# EAGLE design vu (EAGLE 9.3.0)
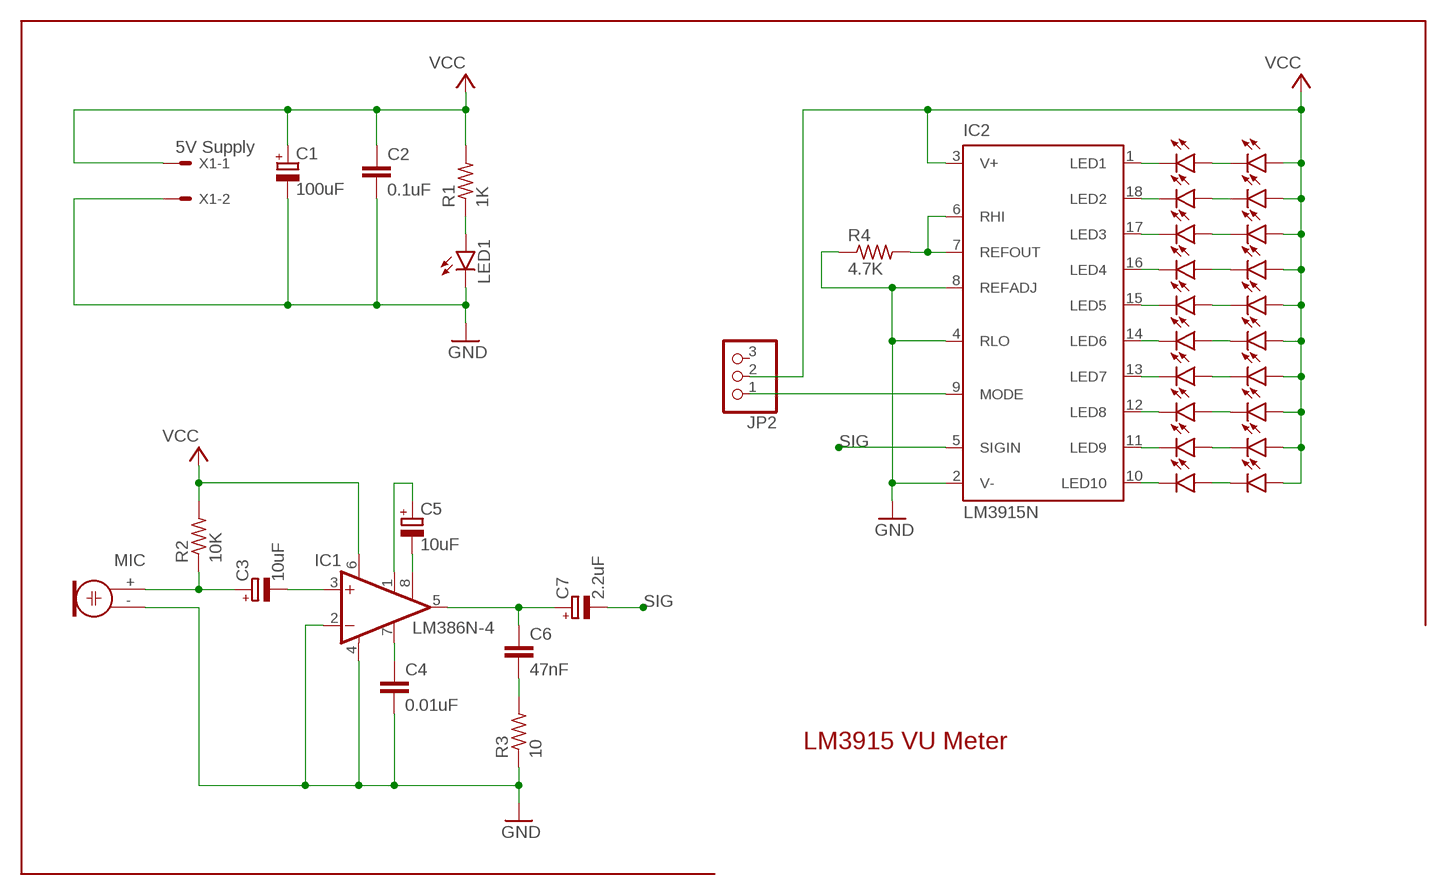
[diagram p0: schematic, sheet 1]

## Parts
C1  100uF  CPOL-EUE2.5-6  [E2,5-6]
C2  0.1uF  C-EU025-050X050  [C025-050X050]
C3  10uF  CPOL-EUE2.5-6  [E2,5-6]
C4  0.01uF  C-EU050-024X044  [C050-024X044]
C5  10uF  CPOL-EUE2.5-6  [E2,5-6]
C6  47nF  C-EU025-050X050  [C025-050X050]
C7  2.2uF  CPOL-EUE5-6  [E5-6]
IC1  LM386N-4  [DIL08]
IC2  LM3915N  [DIL18]
JP2  PINHD-1X3  [1X03]
LED1  LED5MM  [LED5MM]
LED2  LED5MM  [LED5MM]
LED3  LED5MM  [LED5MM]
LED4  LED5MM  [LED5MM]
LED5  LED5MM  [LED5MM]
LED6  LED5MM  [LED5MM]
LED7  LED5MM  [LED5MM]
LED8  LED5MM  [LED5MM]
LED9  LED5MM  [LED5MM]
LED10  LED5MM  [LED5MM]
LED11  LED5MM  [LED5MM]
LED12  LED5MM  [LED5MM]
LED13  LED5MM  [LED5MM]
LED14  LED5MM  [LED5MM]
LED15  LED5MM  [LED5MM]
LED16  LED5MM  [LED5MM]
LED17  LED5MM  [LED5MM]
LED18  LED5MM  [LED5MM]
LED19  LED5MM  [LED5MM]
LED20  LED5MM  [LED5MM]
LED21  LED5MM  [LED5MM]
MIC  ELECTRET  [9.7ELECTRET]
R1  1K  R-US_0207/10  [0207/10]
R2  10K  R-US_0207/10  [0207/10]
R3  10  R-US_0207/10  [0207/10]
R4  4.7K  R-US_0207/10  [0207/10]
X1  5V Supply  KK-156-2  [KK-156-2]

## Nets
GND: C1.- C2.2 C4.2 IC1.2(-IN) IC1.4(GND) IC2.2(V-) IC2.4(RLO) IC2.8(REFADJ) LED1.K(C) MIC.- R3.1 R4.1 X1.2
N$1: C3.+ MIC.+ R2.1
N$2: C3.- IC1.3(+IN)
N$3: C5.+ IC1.1(GAIN)
N$4: LED1.A R1.1
N$5: C5.- IC1.8(GAIN)
N$6: C6.1 C7.+ IC1.5(OUT)
N$7: IC2.6(RHI) IC2.7(REFOUT) R4.2
N$8: C6.2 R3.2
N$9: C4.1 IC1.7(BYPASS)
N$11: IC2.1(LED1) LED2.K(C)
N$12: LED2.A LED3.K(C)
N$13: IC2.18(LED2) LED4.K(C)
N$14: LED4.A LED5.K(C)
N$15: IC2.17(LED3) LED6.K(C)
N$16: LED6.A LED7.K(C)
N$17: LED8.A LED9.K(C)
N$18: IC2.16(LED4) LED8.K(C)
N$19: IC2.15(LED5) LED10.K(C)
N$20: LED10.A LED11.K(C)
N$21: LED12.A LED13.K(C)
N$22: IC2.14(LED6) LED12.K(C)
N$23: IC2.13(LED7) LED14.K(C)
N$24: LED14.A LED15.K(C)
N$25: LED16.A LED17.K(C)
N$26: IC2.12(LED8) LED16.K(C)
N$27: IC2.11(LED9) LED18.K(C)
N$28: LED18.A LED19.K(C)
N$29: LED20.A LED21.K(C)
N$30: IC2.10(LED10) LED20.K(C)
N$31: IC2.9(MODE) JP2.1
SIG: C7.- IC2.5(SIGIN)
VCC: C1.+ C2.1 IC1.6(VS) IC2.3(V+) JP2.2 LED3.A LED5.A LED7.A LED9.A LED11.A LED13.A LED15.A LED17.A LED19.A LED21.A R1.2 R2.2 X1.1
Unconnected: JP2.3

## Notes on the sheet
- LM3915 VU Meter

## Library data of the parts
C1 C3 C5 C7 = rcl:CPOL-EU: POLARIZED CAPACITOR, European symbol; SPICEPREFIX: C
C2 C4 C6 = rcl:C-EU: CAPACITOR, European symbol; SPICEPREFIX: C
IC1 = linear:LM386?-*: Low Voltage Audio Power Amplifier Source: http://cache.national.com/ds/LM/LM386.pdf
IC2 = national-semiconductor:LM391: Dot/Bar Display Driver Source: Data sheet LM3915 <http://www.national.com/ds/LM/LM3915.pdf> Data sheet LM3914 <http://www.national.com/ds/LM/LM3914.pdf>
JP2 = pinhead:PINHD-1X3: PIN HEADER
LED1-LED21 = led:LED: LED OSRAM: - CHIPLED LG R971, LG N971, LY N971, LG Q971, LY Q971, LO R971, LY R971 LH N974, LH R974 LS Q976, LO Q976, LY Q976 LO Q996 - Hyper CHIPLED LW Q18S LB Q993, LB Q99A, LB R99A - SideLED LS A670, LO A670, LY A670, LG A670, LP A670 LB A673, LV A673, LT A673, LW A673 LH A674 LY A675 LS A676, LA A676, LO A676, LY A676, LW A676 LS A679, LY A679, LG A679 - Hyper Micro SIDELED® LS Y876, LA Y876, LO Y876, LY Y876 LT Y87S - SmartLED LW L88C, LW L88S LB L89C, LB L89S, LG L890 LS L89K, LO L89K, LY L89K LS L896, LA L896, LO L896, LY L896 - TOPLED LS T670, LO T670, LY T670, LG T670, LP T670 LSG T670, LSP T670, LSY T670, LOP T670, LYG T670 LG T671, LOG T671, LSG T671 LB T673, LV T673, LT T673, LW T673 LH T674 LS T676, LA T676, LO T676, LY T676, LB T676, LH T676, LSB T676, LW T676 LB T67C, LV T67C, LT T67C, LS T67K, LO T67K, LY T67K, LW E67C LS E67B, LA E67B, LO E67B, LY E67B, LB E67C, LV E67C, LT E67C LW T67C LS T679, LY T679, LG T679 LS T770, LO T770, LY T770, LG T770, LP T770 LB T773, LV T773, LT T773, LW T773 LH T774 LS E675, LA E675, LY E675, LS T675 LS T776, LA T776, LO T776, LY T776, LB T776 LHGB T686 LT T68C, LB T68C - Hyper Mini TOPLED® LB M676 - Mini TOPLED Santana® LG M470 LS M47K, LO M47K, LY M47K Source: http://www.osram.convergy.de LUXEON: - LUMILED® LXK2-PW12-R00, LXK2-PW12-S00, LXK2-PW14-U00, LXK2-PW14-V00 LXK2-PM12-R00, LXK2-PM12-S00, LXK2-PM14-U00 LXK2-PE12-Q00, LXK2-PE12-R00, LXK2-PE12-S00, LXK2-PE14-T00, LXK2-PE14-U00 LXK2-PB12-K00, LXK2-PB12-L00, LXK2-PB12-M00, LXK2-PB14-N00, LXK2-PB14-P00, LXK2-PB14-Q00 LXK2-PR12-L00, LXK2-PR12-M00, LXK2-PR14-Q00, LXK2-PR14-R00 LXK2-PD12-Q00, LXK2-PD12-R00, LXK2-PD12-S00 LXK2-PH12-R00, LXK2-PH12-S00 LXK2-PL12-P00, LXK2-PL12-Q00, LXK2-PL12-R00 Source: www.luxeon.com KINGBRIGHT: KA-3528ASYC Source: www.kingbright.com
MIC = adafruit:ELECTRET: Electret microphone Thru hole 2.54mm spacing with 9.7mm diameter
R1-R4 = rcl:R-US_: RESISTOR, American symbol; SPICEPREFIX: R
X1 = con-molex:KK-156-2: KK 156 HEADER Source: http://www.molex.com/pdm_docs/sd/026604100_sd.pdf; MF: MOLEX; OC_FARNELL: unknown; OC_NEWARK: unknown

## Board
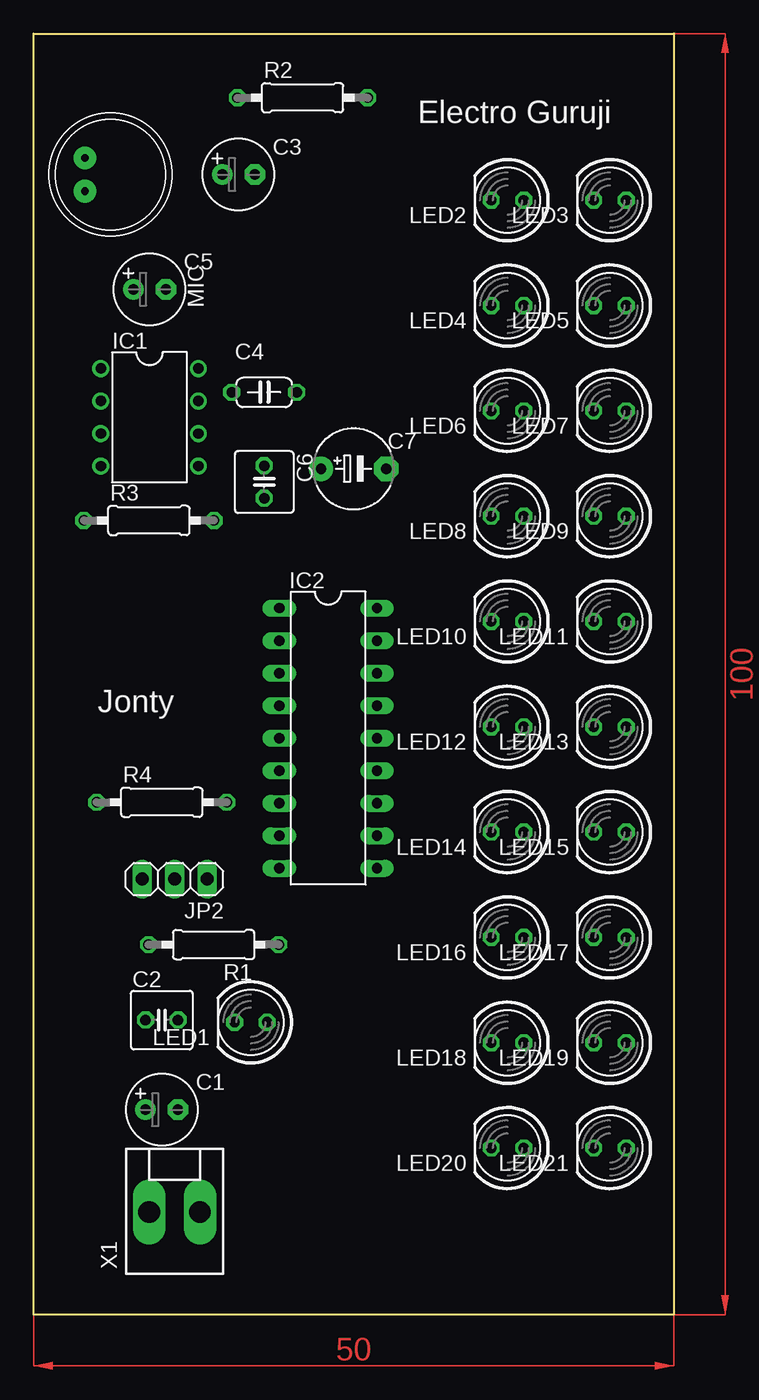
[diagram p1: board, top side]
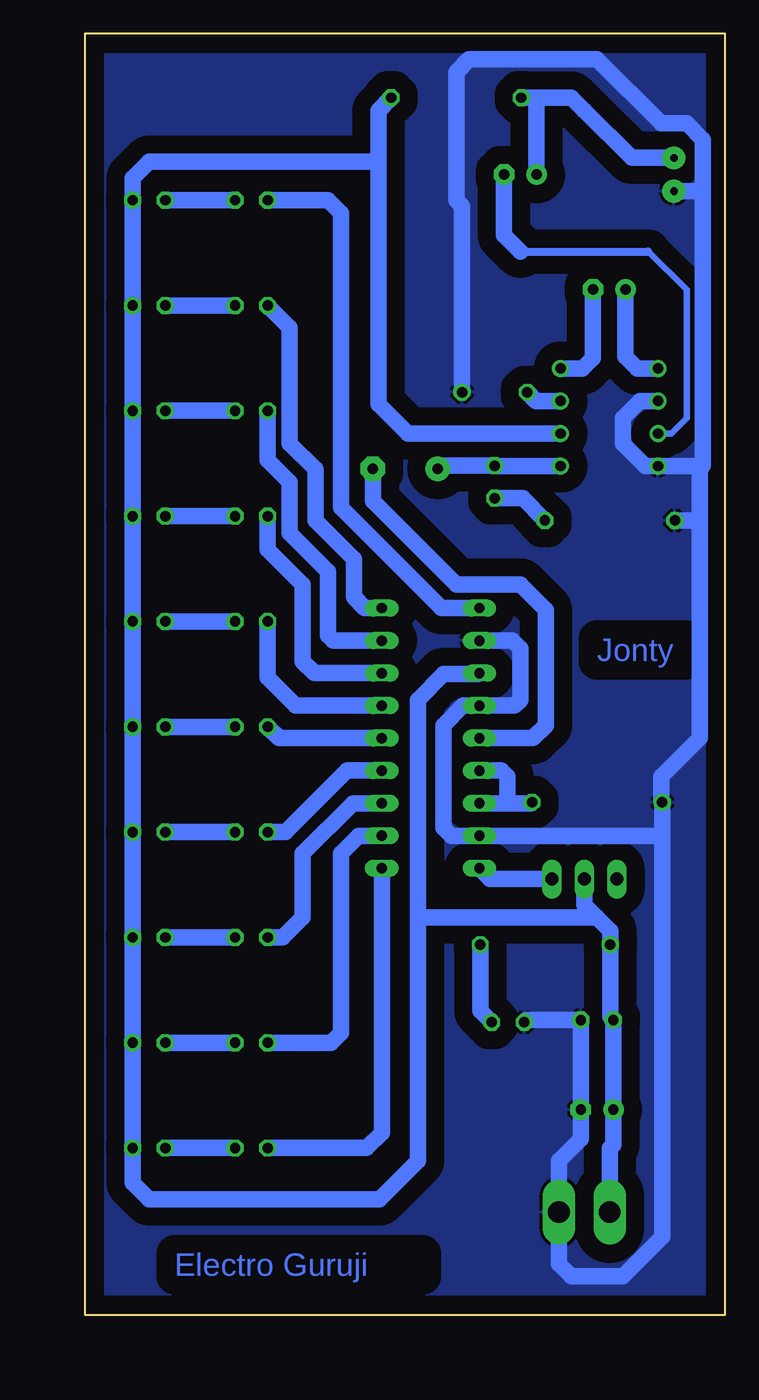
[diagram p2: board, bottom side, seen from below]

Size 50 x 100 mm. Coordinates in mm from the lower left corner, seen from the top.
Outline: 0,100 50,100 50,0 0,0 0,100
Copper layers (1*16): Top 0.035mm / dielectric 1.5mm / Bottom 0.035mm
Design rules "default": minimum track width 6mil, minimum drill 0.35mm, track to track 6mil, track to pad 6mil, pad to pad 6mil, via to via 6mil, smd to smd 6mil, copper to edge 40mil, drill to drill 6mil, minimum pad ring 10mil, minimum via ring 8mil, stop-mask expansion 4mil, vias tented up to drill 0mil, thermal gap 10mil

### Footprints (pad centres in the part's own frame; a part is rotated, then mirrored left to right if it is on the bottom)
E2,5-6 = drill 0.813 pad 1.6: + -1.27,0 | drill 0.813 pad 1.6 octagon: - 1.27,0
C025-050X050 = drill 0.813 octagon: 1 -1.27,0; 2 1.27,0
C050-024X044 = drill 0.813 octagon: 1 -2.54,0; 2 2.54,0
E5-6 = drill 0.813 pad 1.905: + -2.54,0 | drill 0.813 pad 1.905 octagon: - 2.54,0
DIL08 = drill 0.813 pad 1.27: 1 -3.81,-3.81; 2 -1.27,-3.81; 3 1.27,-3.81; 4 3.81,-3.81; 5 3.81,3.81; 6 1.27,3.81; 7 -1.27,3.81; 8 -3.81,3.81
DIL18 = drill 0.813 long: 1 -10.16,-3.81; 2 -7.62,-3.81; 3 -5.08,-3.81; 4 -2.54,-3.81; 5 0,-3.81; 6 2.54,-3.81; 7 5.08,-3.81; 8 7.62,-3.81; 9 10.16,-3.81; 10 10.16,3.81; 11 7.62,3.81; 12 5.08,3.81; 13 2.54,3.81; 14 0,3.81; 15 -2.54,3.81; 16 -5.08,3.81; 17 -7.62,3.81; 18 -10.16,3.81
1X03 = drill 1.016 long: 1 -2.54,0; 2 0,0; 3 2.54,0
LED5MM = drill 0.813 octagon: A -1.27,0; K 1.27,0
9.7ELECTRET = drill 0.6 pad 1.778: + 1.3,2; - -1.3,2
0207/10 = drill 0.813 octagon: 1 -5.08,0; 2 5.08,0
KK-156-2 = drill 1.7 pad 2.184 long: 1 -1.98,0; 2 1.98,0

### Placement (x,y rotation side)
C1  10,16 0 top
C2  10,23 0 top
C3  16,89 0 top
C4  18,72 0 top
C5  9.05,80.04 0 top
C6  18,65 270 top
C7  24.98,66.04 0 top
IC1  9.05,70.05 270 top
IC2  23,45 270 top
JP2  11,34 180 top
LED1  16.96,22.82 180 top
LED2  37,87 180 top
LED3  45,87 180 top
LED4  37,78.78 180 top
LED5  45,78.78 180 top
LED6  37,70.56 180 top
LED7  45,70.56 180 top
LED8  37,62.33 180 top
LED9  45,62.33 180 top
LED10  37,54.11 180 top
LED11  45,54.11 180 top
LED12  37,45.89 180 top
LED13  45,45.89 180 top
LED14  37,37.67 180 top
LED15  45,37.67 180 top
LED16  37,29.44 180 top
LED17  45,29.44 180 top
LED18  37,21.22 180 top
LED19  45,21.22 180 top
LED20  37,13 180 top
LED21  45,13 180 top
MIC  6,89 90 top
R1  14.05,28.88 180 top
R2  21,95 0 top
R3  9,62 0 top
R4  10,40 0 top
X1  11,8 0 top

### Tracks (layer width: path | path; a pad name or v marks a point on that pad's centre or on a via)
GND
  Bottom 1.27: IC2.2 16.62,52.62 16,52 16,48 16.46,47.54 IC2.4 20.46,47.54 22,46 22,38 21.38,37.38 IC2.8 5.3,37.38 4.92,37 | LED1.K 15.51,23 C2.2 C1.- 11.27,13.73 12.98,12.02 X1.2 12.98,3.98 12,3 8,3 4.92,6.08 4.92,37 | 4.92,37 R4.1 5,40.08 5,42 2,45 2,62 | 2,66 2,62 | R3.1 2,62 | 2,66 2.24,66.24 IC1.4 6.24,66.24 8,68 8,70 6.68,71.32 IC1.2 | C4.2 20.54,86.54 21,87 21,97 20,98 10,98 5,93 3,93 1.73,91.73 1.73,88 | MIC.- 2.03,87.7 1.73,88 | 2,66 1.73,66.27 1.73,88
  pour Bottom (isolate 1.422): 0,100 50,100 50,0 0,0
N$1
  Bottom 1.27: 15,95 R2.1 | C3.+ 14.73,94.73 15,95 | 15,95 12,95 11,94 7.3,90.3 MIC.+
N$2
  Bottom 0.508: IC1.3 4.22,68.78 3,70 3,80 6,83
  Bottom 0.61: 16,83 6,83
  Bottom 1.27: C3.- 17.27,84.27 16,83
N$3
  Bottom 1.27: IC1.1 6.86,73.86 7.78,74.78 C5.+
N$4
  Bottom 1.27: LED1.A 19.13,23.72 R1.1
N$5
  Bottom 1.27: C5.- 10.32,74.68 11.14,73.86 IC1.8
N$6
  Bottom 1.27: IC1.5 17.97,66.24 C6.1 22.21,66.27 C7.+
N$7
  Bottom 1.27: IC2.7 17,39.92 | 17,39.92 15.16,39.92 R4.2 | IC2.6 17.46,42.46 17,42 17,39.92
N$8
  Bottom 1.27: R3.2 15.81,63.73 C6.2
N$9
  Bottom 1.27: IC1.7 14.78,71.32 C4.1
N$11
  Bottom 1.27: IC2.1 22.16,55.16 30,63 30,86 31,87 | 31,87 | 31,87 LED2.K
N$12
  Bottom 1.27: LED3.K LED2.A | LED2.A
N$13
  Bottom 1.27: LED4.K 34,77.05 34,68 32,66 32,62 29,59 29,56 28.16,55.16 IC2.18
N$14
  Bottom 1.27: LED4.A LED5.K | LED5.K
N$15
  Bottom 1.27: IC2.17 30.62,52.62 31,53 31,58 34,61 34,65 35.73,66.73 LED6.K
N$16
  Bottom 1.27: LED6.A LED7.K | LED7.K
N$17
  Bottom 1.27: LED8.A LED9.K | LED9.K
N$18
  Bottom 1.27: IC2.16 32.08,50.08 33,51 33,57 35.73,59.73 LED8.K
N$19
  Bottom 1.27: IC2.15 33.54,47.54 35.73,49.73 LED10.K
N$20
  Bottom 1.27: LED11.K LED10.A | LED10.A
N$21
  Bottom 1.27: LED13.K LED12.A | LED12.A
N$22
  Bottom 1.27: LED12.K 34.84,45 IC2.14
N$23
  Bottom 1.27: IC2.13 29.54,42.46 34.33,37.67 LED14.K
N$24
  Bottom 1.27: LED14.A LED15.K | LED15.K
N$25
  Bottom 1.27: LED16.A LED17.K | LED17.K
N$26
  Bottom 1.27: IC2.12 29.08,39.92 33,36 33,31 34.56,29.44 LED16.K
N$27
  Bottom 1.27: LED18.K 30.78,21.22 30,22 30,36 28.62,37.38 IC2.11
N$28
  Bottom 1.27: LED18.A LED19.K | LED19.K
N$29
  Bottom 1.27: LED20.A LED21.K
N$30
  Bottom 1.27: IC2.10 26.81,14.19 28,13 LED20.K
N$31
  Bottom 1.27: IC2.9 18.35,34 JP2.1
SIG
  Bottom 1.27: IC2.5 15,45 14,46 14,55 16,57 21,57 27.52,63.52 C7.-
VCC
  Bottom 1.27: IC2.3 19.27,50 22,50 24,48 24,31 | 24,31 24,12 27,9 45,9 46.27,10.27 LED21.A LED19.A LED17.A LED15.A LED13.A LED11.A LED9.A LED7.A LED5.A LED3.A 46.27,88.73 45,90 27.08,90 | JP2.2 11,32 10,31 | 10,31 8.97,29.97 R1.2 8.97,23.24 C2.1 C1.+ 8.73,13.27 9.02,12.98 X1.1 | 24,31 10,31 | IC1.6 24.78,68.78 27.08,71.08 27.08,90 | R2.2 27.08,94 27.08,90
(copper drawn outside any net)
  shapes: Top area x2

### Text on the board
Bottom: Jonty | Electro Guruji
tPlace: Electro Guruji | Jonty